# EAGLE design DC950TestSystem (EAGLE 6.6.0)
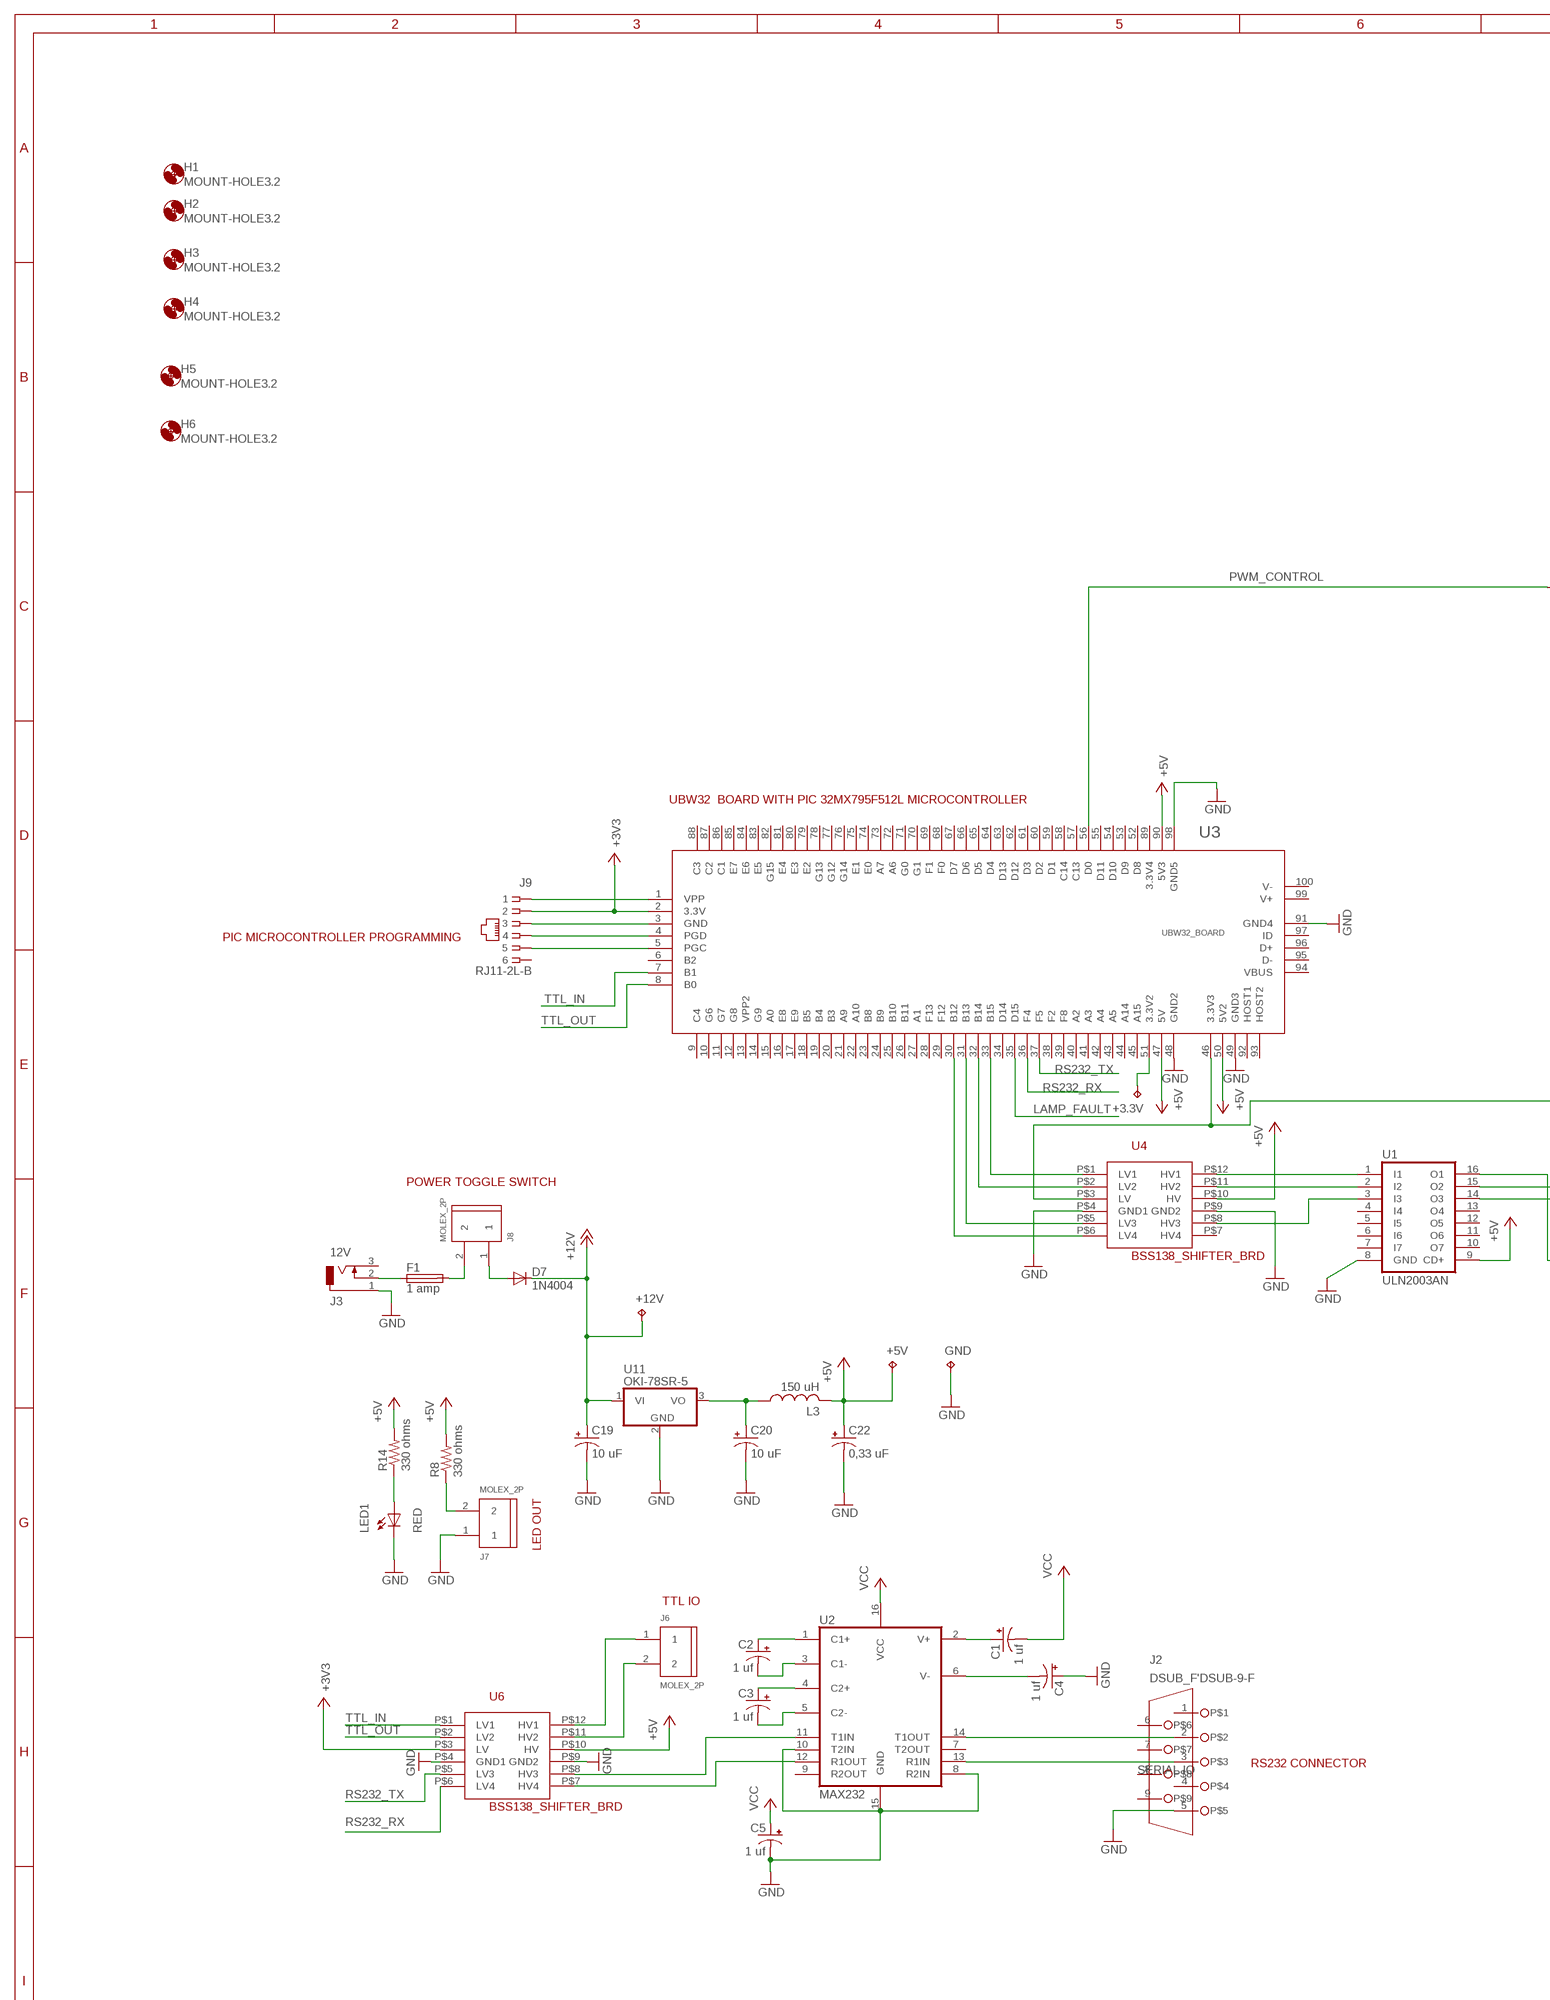
[diagram p0: schematic, sheet 1, part 1 of 2]
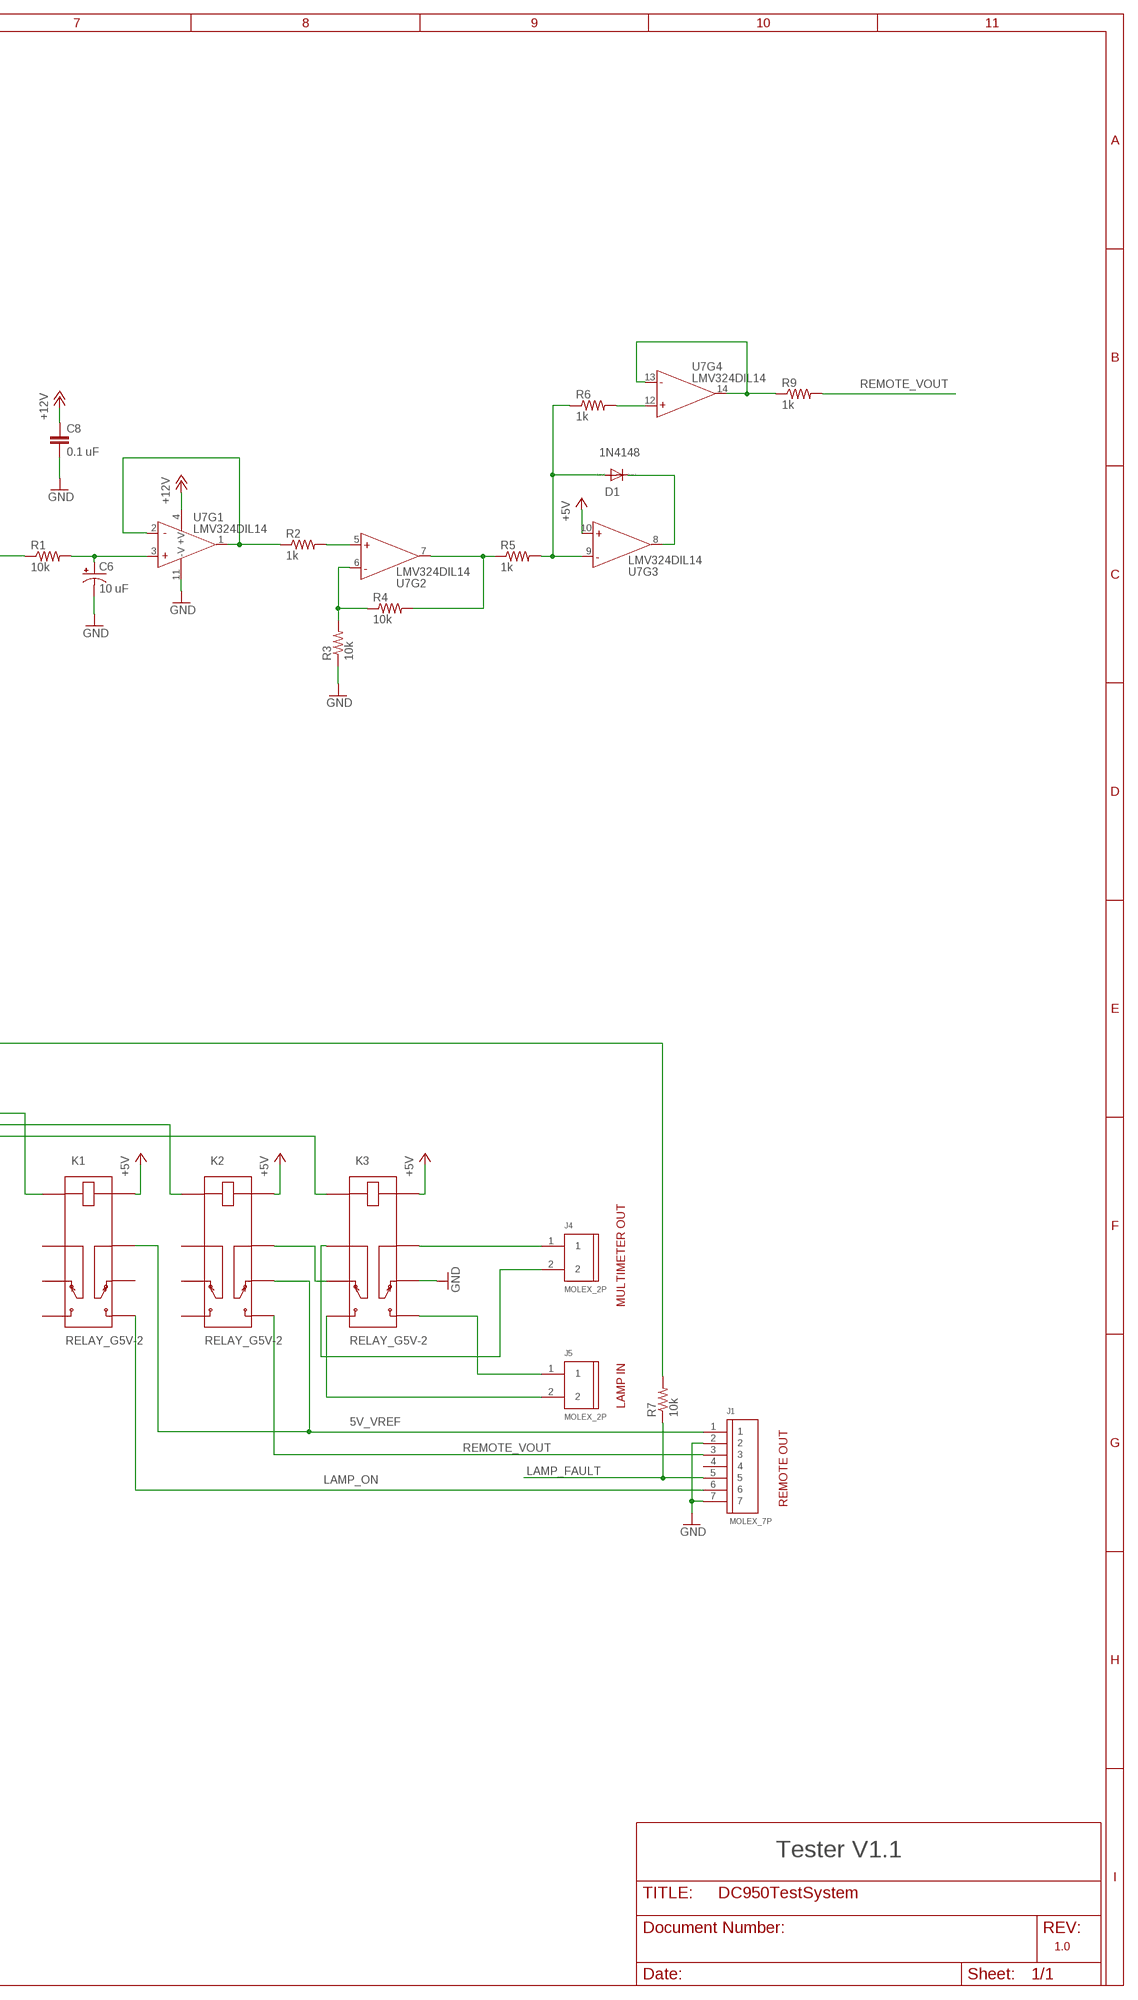
[diagram p1: schematic, sheet 1, part 2 of 2]

## Parts
+3.3V  TP  [TESTPAD]
+5V  TP  [TESTPAD]
+12V  TP  [TESTPAD]
C1  1 uf  CPOL-USE2-5  [E2-5]
C2  1 uf  CPOL-USE2-5  [E2-5]
C3  1 uf  CPOL-USE2-5  [E2-5]
C4  1 uf  CPOL-USE2-5  [E2-5]
C5  1 uf  CPOL-USE2-5  [E2-5]
C6  10 uF  CPOL-USE2-5  [E2-5]
C8  0.1 uF  C5/2.5  [C5B2.5]
C19  10 uF  CPOL-USE2-5  [E2-5]
C20  10 uF  CPOL-USE2-5  [E2-5]
C22  0,33 uF  CPOL-USE2-5  [E2-5]
D1  1N4148  1N4148DO35-10  [DO35-10]
D7  1N4004  [DO41-10]
F1  1 amp  SH22,5  [SH22,5]
GND  TP  [TESTPAD]
H1  MOUNT-HOLE3.2  [3,2]
H2  MOUNT-HOLE3.2  [3,2]
H3  MOUNT-HOLE3.2  [3,2]
H4  MOUNT-HOLE3.2  [3,2]
H5  MOUNT-HOLE3.2  [3,2]
H6  MOUNT-HOLE3.2  [3,2]
J1  MOLEX_7P  [MOLEX_7P]
J2  DSUB_F'DSUB-9-F  [H5M09RA]
J3  12V  DCJ0303  [DCJ0303]
J4  MOLEX_2P  [MOLEX_2P]
J5  MOLEX_2P  [MOLEX_2P]
J6  MOLEX_2P  [MOLEX_2P]
J7  MOLEX_2P  [MOLEX_2P]
J8  MOLEX_2P  [MOLEX_2P]
J9  RJ11-2L-B  [RJ11-NO_SHIELD]
K1  RELAY_G5V-2  [RELAY_G5V-2]
K2  RELAY_G5V-2  [RELAY_G5V-2]
K3  RELAY_G5V-2  [RELAY_G5V-2]
L3  150 uH  L-US0204/7  [0204/7]
LED1  RED  LED5MM  [LED5MM]
R1  10k  RESISTOR0207/12  [1/4_WATT]
R2  1k  RESISTOR0207/12  [1/4_WATT]
R3  10k  RESISTOR0207/12  [1/4_WATT]
R4  10k  RESISTOR0207/12  [1/4_WATT]
R5  1k  RESISTOR0207/12  [1/4_WATT]
R6  1k  RESISTOR0207/12  [1/4_WATT]
R7  10k  RESISTOR0207/12  [1/4_WATT]
R8  330 ohms  R-US_0207/10  [0207/10]
R9  1k  RESISTOR0207/12  [1/4_WATT]
R14  330 ohms  R-US_0207/10  [0207/10]
U1  ULN2003AN  [DIL16]
U2  MAX232  [DIL16]
U3  UBW32_BOARD  [UBW32]
U4  BSS138_SHIFTER_BRD  [BSS138_SHIFTER_BRD]
U6  BSS138_SHIFTER_BRD  [BSS138_SHIFTER_BRD]
U7  LMV324DIL14  [DIL14]
U11  OKI-78SR-5  7805TV  [TO220V]

## Nets
5V_VREF: J1.1 K1.13 K2.11
+3V3: J9.2 U3.2(3.3V) U6.P$3(LV)
+5V: +5V.P$1(TP) C22.+ K1.16 K2.16 K3.16 L3.2 R8.2 R14.2 U1.9(CD+) U3.47(5V) U3.50(5V2) U3.90(5V3) U4.P$10(HV) U6.P$10(HV) U7.10(+IN)
+12V: +12V.P$1(TP) C8.1 C19.+ D7.C U7.4(+V) U11.1(VI)
GND: C4.+ C5.- C6.- C8.2 C19.- C20.- C22.- GND.P$1(TP) J1.2 J1.7 J2.5 J3.1 J7.1 K3.11 LED1.K(C) R3.1 U1.8(GND) U2.8(R2IN) U2.10(T2IN) U2.15(GND) U3.48(GND2) U3.49(GND3) U3.91(GND4) U3.98(GND5) U4.P$4(GND1) U4.P$9(GND2) U6.P$4(GND1) U6.P$9(GND2) U7.11(-V) U11.2(GND)
LAMP_FAULT: J1.5 R7.1 U3.35(D15)
LAMP_ON: J1.6 K1.9
N$1: F1.1 J3.2
N$2: J9.3 U3.3(GND)
N$3: F1.2 J8.2
N$4: U2.12(R1OUT) U6.P$7(HV4)
N$5: U2.11(T1IN) U6.P$8(HV3)
N$6: J9.1 U3.1(VPP)
N$7: J6.1 U6.P$12(HV1)
N$8: J9.4 U3.4(PGD)
N$9: J9.5 U3.5(PGC)
N$10: R2.1 U7.1(OUT) U7.2(-IN)
N$11: C6.+ R1.2 U7.3(+IN)
N$12: R3.2 R4.1 U7.6(-IN)
N$13: R4.2 R5.1 U7.7(OUT)
N$14: J6.2 U6.P$11(HV2)
N$15: R2.2 U7.5(+IN)
N$16: D1.A R5.2 R6.1 U7.9(-IN)
N$17: D1.C U7.8(OUT)
N$18: LED1.A R14.1
N$19: J2.2 U2.14(T1OUT)
N$20: J2.3 U2.13(R1IN)
N$21: R6.2 U7.12(+IN)
N$22: R7.2 U3.46(3.3V3) U4.P$3(LV)
N$23: C2.+ U2.1(C1+)
N$24: C2.- U2.3(C1-)
N$25: C3.+ U2.4(C2+)
N$26: C3.- U2.5(C2-)
N$27: C1.+ U2.2(V+)
N$28: C4.- U2.6(V-)
N$29: U3.33(B15) U4.P$1(LV1)
N$30: U3.32(B14) U4.P$2(LV2)
N$31: U3.31(B13) U4.P$5(LV3)
N$32: U3.30(B12) U4.P$6(LV4)
N$33: +3.3V.P$1(TP) U3.51(3.3V2)
N$34: U1.1(I1) U4.P$12(HV1)
N$35: U1.2(I2) U4.P$11(HV2)
N$36: U1.3(I3) U4.P$8(HV3)
N$37: J7.2 R8.1
N$38: K1.1 U1.16(O1)
N$39: K2.1 U1.15(O2)
N$40: K3.1 U1.14(O3)
N$41: D7.A J8.1
N$42: C20.+ L3.1 U11.3(VO)
N$43: J4.1 K3.13
N$44: J4.2 K3.4
N$45: J5.1 K3.9
N$46: J5.2 K3.8
N$47: K2.13 K3.6
N$48: R9.1 U7.13(-IN) U7.14(OUT)
PWM_CONTROL: R1.1 U3.56(D0)
REMOTE_VOUT: J1.3 K2.9 R9.2
RS232_RX: U3.36(F4) U6.P$6(LV4)
RS232_TX: U3.37(F5) U6.P$5(LV3)
TTL_IN: U3.7(B1) U6.P$1(LV1)
TTL_OUT: U3.8(B0) U6.P$2(LV2)
VCC: C1.- C5.+ U2.16(VCC)
Unconnected: J1.4 J2.1 J2.4 J2.6 J2.7 J2.8 J2.9 J3.3 J9.6 K1.4 K1.6 K1.8 K1.11 K2.4 K2.6 K2.8 U1.4(I4) U1.5(I5) U1.6(I6) U1.7(I7) U1.10(O7) U1.11(O6) U1.12(O5) U1.13(O4) U2.7(T2OUT) U2.9(R2OUT) U3.6(B2) U3.9(C4) U3.10(G6) U3.11(G7) U3.12(G8) U3.13(VPP2) U3.14(G9) U3.15(A0) U3.16(E8) U3.17(E9) U3.18(B5) U3.19(B4) U3.20(B3) U3.21(A9) U3.22(A10) U3.23(B8) U3.24(B9) U3.25(B10) U3.26(B11) U3.27(A1) U3.28(F13) U3.29(F12) U3.34(D14) U3.38(F2) U3.39(F8) U3.40(A2) U3.41(A3) U3.42(A4) U3.43(A5) U3.44(A14) U3.45(A15) U3.52(D8) U3.53(D9) U3.54(D10) U3.55(D11) U3.57(C13) U3.58(C14) U3.59(D1) U3.60(D2) U3.61(D3) U3.62(D12) U3.63(D13) U3.64(D4) U3.65(D5) U3.66(D6) U3.67(D7) U3.68(F0) U3.69(F1) U3.70(G1) U3.71(G0) U3.72(A6) U3.73(A7) U3.74(E0) U3.75(E1) U3.76(G14) U3.77(G12) U3.78(G13) U3.79(E2) U3.80(E3) U3.81(E4) U3.82(G15) U3.83(E5) U3.84(E6) U3.85(E7) U3.86(C1) U3.87(C2) U3.88(C3) U3.92(HOST1) U3.93(HOST2) U3.95(D-) U3.96(D+) U3.97(ID) U4.P$7(HV4)

## Notes on the sheet
- UBW32  BOARD WITH PIC 32MX795F512L MICROCONTROLLER
- PIC MICROCONTROLLER PROGRAMMING
- POWER TOGGLE SWITCH
- MULTIMETER OUT
- LAMP IN
- LED OUT
- REMOTE OUT
- TTL IO
- RS232 CONNECTOR
- SERIAL IO
- Tester V1.1
- 1.0

## Power pins joined to a net without a drawn wire
3.3V4: U3.89(3.3V4)
V+: U3.99(V+)
V-: U3.100(V-)
VBUS: U3.94(VBUS)

## Library data of the parts
+3.3V +5V +12V GND = JimLib:TP: Test pad
C1-C6 C19 C20 C22 = rcl:CPOL-US: POLARIZED CAPACITOR, American symbol
C8 = capacitor-wima:C: CAPACITOR naming: grid - package width
D1 = JimLib:1N4148: DIODE high speed (Philips)
D7 = diode:1N4004: DIODE general purpose rectifier, 1 A
F1 = fuse:SH22,5: FUSE HOLDER grid 22,5 mm, OGN0031 8201, Schurter (Buerklin); MF: SCHURTER; MPN: 0031.8201; OC_FARNELL: 1162740; OC_NEWARK: 96F8317
H1-H6 = holes:MOUNT-HOLE: MOUNTING HOLE with drill center marker
J1 = JimLib:MOLEX_7P
J2 = Jim Lib1:DSUB_F: FEMALE RIGHT ANGLE DSUB 9
J3 = con-jack:DCJ0303: DC POWER JACK Source: DCJ0303.pdf; OC_FARNELL: unknown; OC_NEWARK: unknown
J4-J8 = JimLib:MOLEX_2P
J9 = con-tycoelectronics:RJ11: CORCOM Modular RJ Jacks No Shield Source: www.tycoelectronics.com .. ENG_DS_1654001_1099_RJ_L_0507.pdf; MF: TYCO ELECTRONICS; MPN: RJ11-2L-B; OC_FARNELL: unknown; OC_NEWARK: 83F4463
K1-K3 = JimLib:RELAY_G5V-2
L3 = resistor:L-US: INDUCTOR, American symbol
LED1 = led:LED: LED OSRAM: - CHIPLED LG R971, LG N971, LY N971, LG Q971, LY Q971, LO R971, LY R971 LH N974, LH R974 LS Q976, LO Q976, LY Q976 LO Q996 - Hyper CHIPLED LW Q18S LB Q993, LB Q99A, LB R99A - SideLED LS A670, LO A670, LY A670, LG A670, LP A670 LB A673, LV A673, LT A673, LW A673 LH A674 LY A675 LS A676, LA A676, LO A676, LY A676, LW A676 LS A679, LY A679, LG A679 - Hyper Micro SIDELED® LS Y876, LA Y876, LO Y876, LY Y876 LT Y87S - SmartLED LW L88C, LW L88S LB L89C, LB L89S, LG L890 LS L89K, LO L89K, LY L89K LS L896, LA L896, LO L896, LY L896 - TOPLED LS T670, LO T670, LY T670, LG T670, LP T670 LSG T670, LSP T670, LSY T670, LOP T670, LYG T670 LG T671, LOG T671, LSG T671 LB T673, LV T673, LT T673, LW T673 LH T674 LS T676, LA T676, LO T676, LY T676, LB T676, LH T676, LSB T676, LW T676 LB T67C, LV T67C, LT T67C, LS T67K, LO T67K, LY T67K, LW E67C LS E67B, LA E67B, LO E67B, LY E67B, LB E67C, LV E67C, LT E67C LW T67C LS T679, LY T679, LG T679 LS T770, LO T770, LY T770, LG T770, LP T770 LB T773, LV T773, LT T773, LW T773 LH T774 LS E675, LA E675, LY E675, LS T675 LS T776, LA T776, LO T776, LY T776, LB T776 LHGB T686 LT T68C, LB T68C - Hyper Mini TOPLED® LB M676 - Mini TOPLED Santana® LG M470 LS M47K, LO M47K, LY M47K Source: http://www.osram.convergy.de LUXEON: - LUMILED® LXK2-PW12-R00, LXK2-PW12-S00, LXK2-PW14-U00, LXK2-PW14-V00 LXK2-PM12-R00, LXK2-PM12-S00, LXK2-PM14-U00 LXK2-PE12-Q00, LXK2-PE12-R00, LXK2-PE12-S00, LXK2-PE14-T00, LXK2-PE14-U00 LXK2-PB12-K00, LXK2-PB12-L00, LXK2-PB12-M00, LXK2-PB14-N00, LXK2-PB14-P00, LXK2-PB14-Q00 LXK2-PR12-L00, LXK2-PR12-M00, LXK2-PR14-Q00, LXK2-PR14-R00 LXK2-PD12-Q00, LXK2-PD12-R00, LXK2-PD12-S00 LXK2-PH12-R00, LXK2-PH12-S00 LXK2-PL12-P00, LXK2-PL12-Q00, LXK2-PL12-R00 Source: www.luxeon.com KINGBRIGHT: KA-3528ASYC Source: www.kingbright.com
R1-R7 R9 = JimLib:RESISTOR: RESISTOR, American symbol
R8 R14 = resistor:R-US_: RESISTOR, American symbol
U1 = uln-udn:ULN2003A: DRIVER ARRAY
U2 = Jim Lib1:MAX232: RS232 TRANSCEIVER; MF: MAXIM; MPN: MAX232ACPE+; OC_FARNELL: 9723773; OC_NEWARK: 68K4544
U3 = JimLib:UBW32_BOARD: UBW32 - 32 bit PIC32 based USB Bit Whacker Version 2.6 Technical Specifications: PIC 32MX795F512L 8.0 Mhz Crystal VCC: 7.6-15V
U4 U6 = JimLib:BSS138_SHIFTER_BRD
U7 = JimLib:LMV324: Jellybean quad op-amp
U11 = linear:78*: Positive VOLTAGE REGULATOR Source: http://cache.national.com/ds/LM/LM78L05.pdf http://www.fairchildsemi.com/ds/LM/LM7805.pdf

## Board
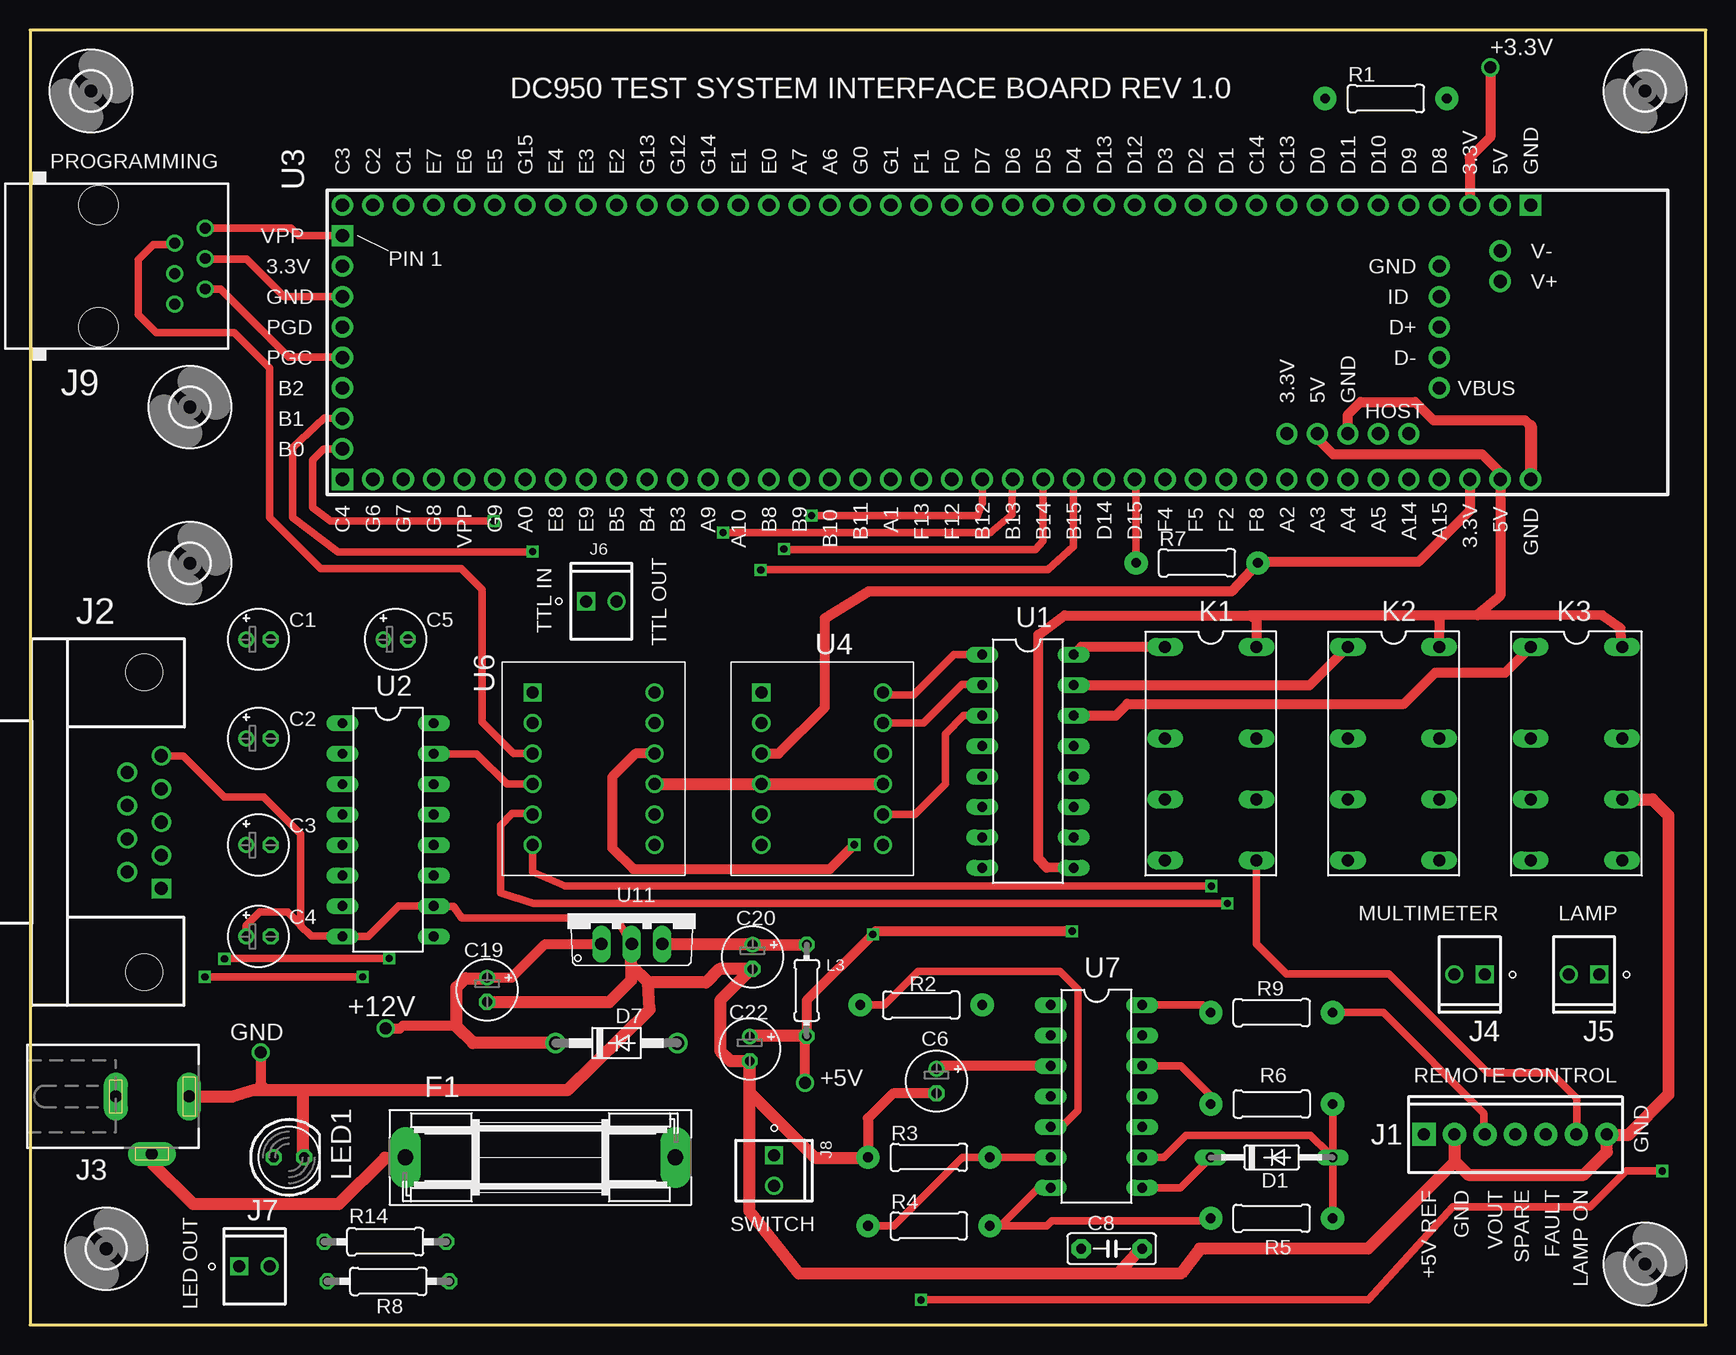
[diagram p2: board, top side]
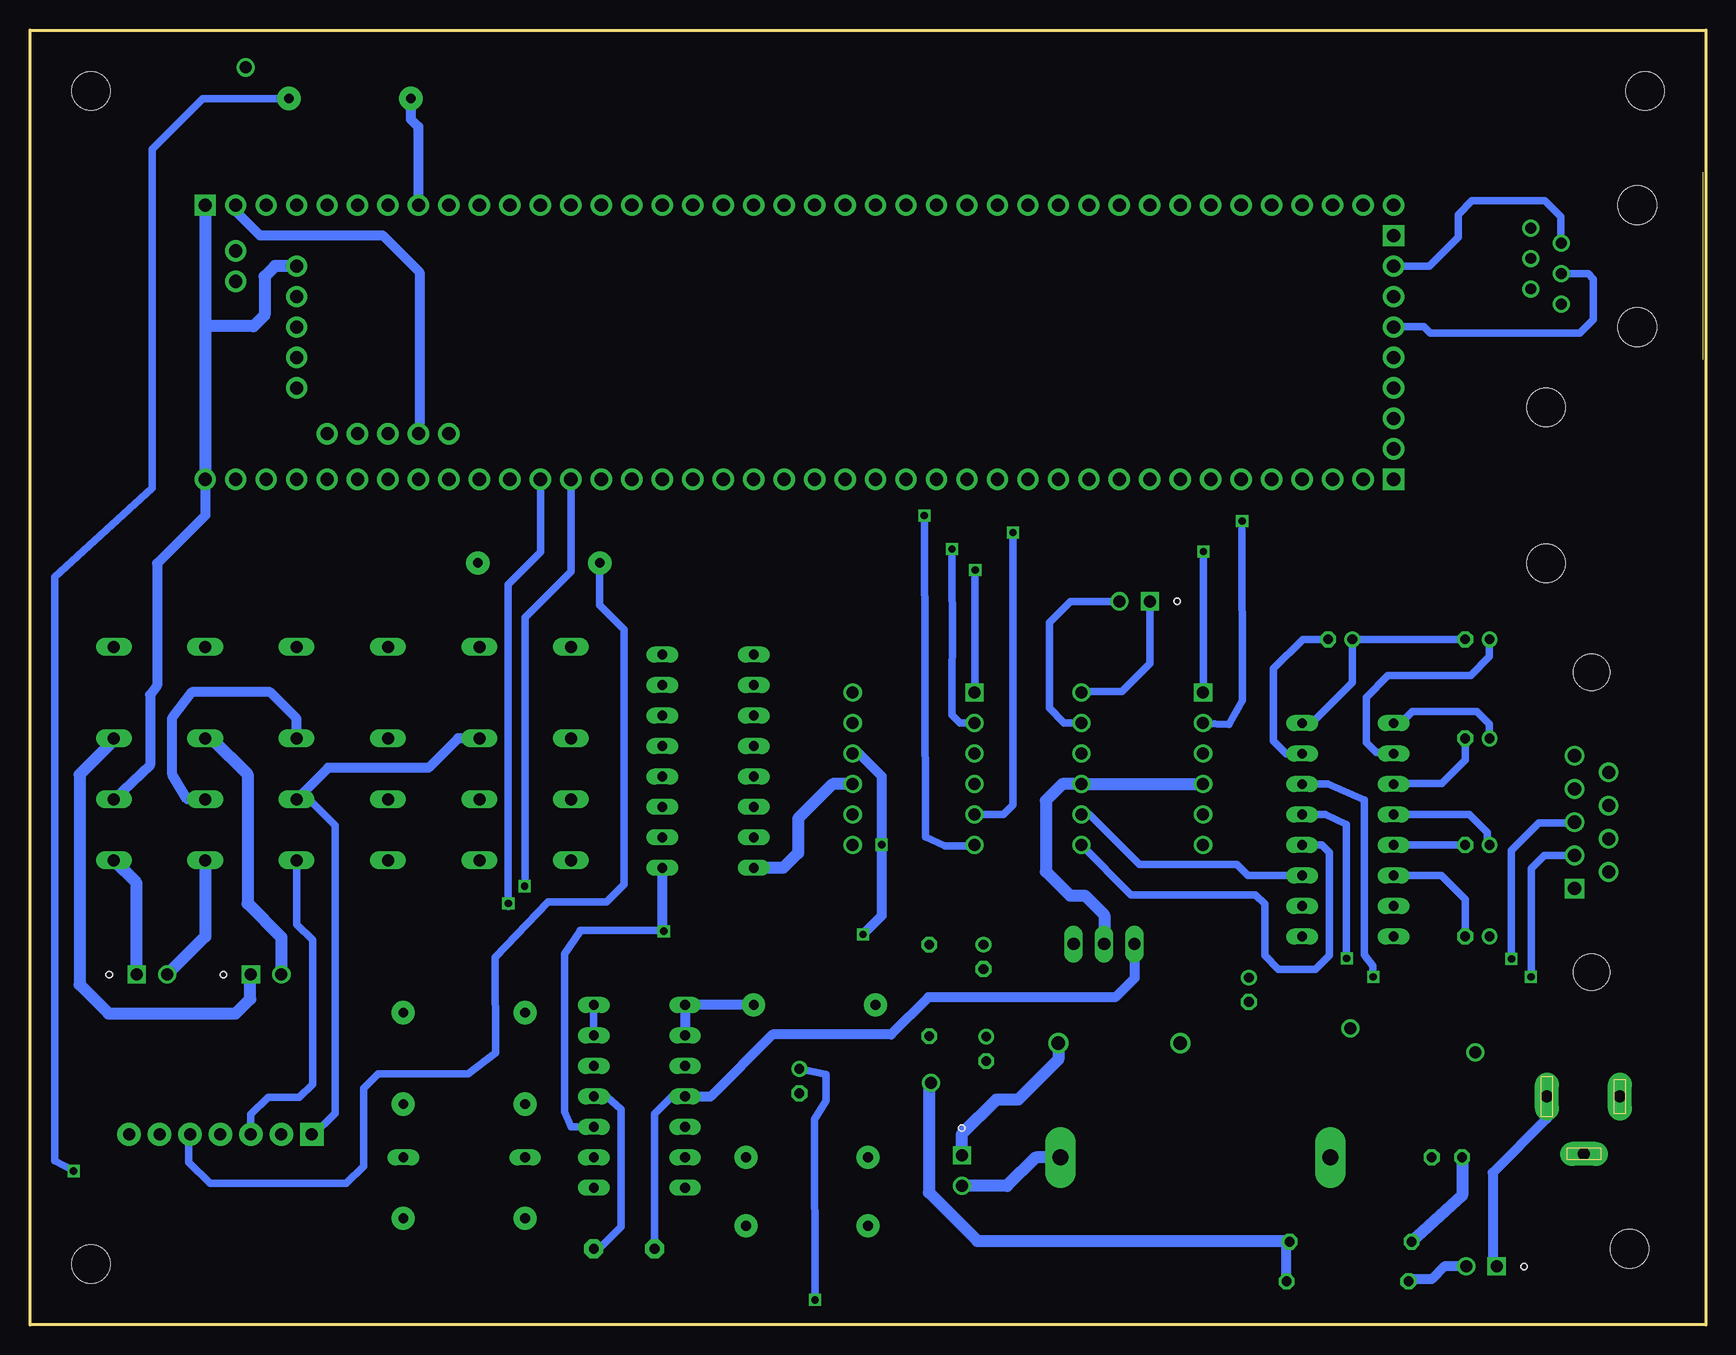
[diagram p3: board, bottom side, seen from below]

Size 139.7 x 107.95 mm. Coordinates in mm from the lower left corner, seen from the top.
Outline: 0,0 139.7,0 139.7,107.95 0,107.95 0,0
Copper layers (1*16): Top 0.035mm / dielectric 1.5mm / Bottom 0.035mm
Design rules "default *": minimum track width 10mil, minimum drill 19mil, track to track 8mil, track to pad 8mil, pad to pad 8mil, via to via 8mil, smd to smd 8mil, copper to edge 40mil, drill to drill 8mil, minimum pad ring 10mil, minimum via ring 8mil, stop-mask expansion 4mil, vias tented up to drill 0mil, thermal gap 10mil

### Footprints (pad centres in the part's own frame; a part is rotated, then mirrored left to right if it is on the bottom)
TESTPAD = drill 1: P$1 0,0
E2-5 = drill 0.813 pad 1.27: + -1.016,0 | drill 0.813 pad 1.27 octagon: - 1.016,0
C5B2.5 = drill 0.813 pad 1.6 octagon: 1 -2.54,0; 2 2.54,0
DO35-10 = drill 0.813 long: A 5.08,0; C -5.08,0
DO41-10 = drill 1.118: A 5.08,0; C -5.08,0
SH22,5 = drill 1.321 pad 2.54 long: 1 -11.252,0; 2 11.252,0
3,2 = hole 3.2: 0,0
MOLEX_7P = drill 1 pad 1.93 square: 1 -3.81,0 | drill 1 pad 1.93: 2 -1.27,0; 3 1.27,0; 4 3.81,0; 5 6.35,0; 6 8.89,0; 7 11.43,0
H5M09RA = drill 1.092 square: 1 5.537,1.422 | drill 1.092: 2 2.769,1.422; 3 0,1.422; 4 -2.769,1.422; 5 -5.537,1.422; 6 4.153,-1.422; 7 1.384,-1.422; 8 -1.384,-1.422; 9 -4.153,-1.422 | hole 3.048: -12.497,0; 12.497,0
DCJ0303 = drill 1 pad 2 long: 1 0,3.1; 2 4.8,0; 3 0,-3
MOLEX_2P = drill 1 square: 1 -1.27,0 | drill 1: 2 1.27,0
RJ11-NO_SHIELD = drill 0.9 pad 1.4: 1 -3.175,8.89; 2 -1.905,6.35; 3 -0.635,8.89; 4 0.635,6.35; 5 1.905,8.89; 6 3.175,6.35 | hole 3.251: -5.08,0; 5.08,0
RELAY_G5V-2 = drill 1 long: 1 -5.08,-3.81; 4 2.54,-3.81; 6 7.62,-3.81; 8 12.7,-3.81; 9 12.7,3.81; 11 7.62,3.81; 13 2.54,3.81; 16 -5.08,3.81
0204/7 = drill 0.813 octagon: 1 -3.81,0; 2 3.81,0
LED5MM = drill 0.813 octagon: A -1.27,0; K 1.27,0
1/4_WATT = drill 0.813 pad 1.93: 1 -5.08,0; 2 5.08,0
0207/10 = drill 0.813 octagon: 1 -5.08,0; 2 5.08,0
DIL16 = drill 0.813 long: 1 -8.89,-3.81; 2 -6.35,-3.81; 3 -3.81,-3.81; 4 -1.27,-3.81; 5 1.27,-3.81; 6 3.81,-3.81; 7 6.35,-3.81; 8 8.89,-3.81; 9 8.89,3.81; 10 6.35,3.81; 11 3.81,3.81; 12 1.27,3.81; 13 -1.27,3.81; 14 -3.81,3.81; 15 -6.35,3.81; 16 -8.89,3.81
UBW32 = drill 1.1 pad 1.778 square: 1 -49.53,8.89; 9 -49.53,-11.43; 49 49.53,11.43 | drill 1.1 pad 1.778: 2 -49.53,6.35; 3 -49.53,3.81; 4 -49.53,1.27; 5 -49.53,-1.27; 6 -49.53,-3.81; 7 -49.53,-6.35; 8 -49.53,-8.89; 10 -46.99,-11.43; 11 -44.45,-11.43; 12 -41.91,-11.43; 13 -39.37,-11.43; 14 -36.83,-11.43; 15 -34.29,-11.43; 16 -31.75,-11.43; 17 -29.21,-11.43; 18 -26.67,-11.43; 19 -24.13,-11.43; 20 -21.59,-11.43; 21 -19.05,-11.43; 22 -16.51,-11.43; 23 -13.97,-11.43; 24 -11.43,-11.43; 25 -8.89,-11.43; 26 -6.35,-11.43; 27 -3.81,-11.43; 28 -1.27,-11.43; 29 1.27,-11.43; 30 3.81,-11.43; 31 6.35,-11.43; 32 8.89,-11.43; 33 11.43,-11.43; 34 13.97,-11.43; 35 16.51,-11.43; 36 19.05,-11.43; 37 21.59,-11.43; 38 24.13,-11.43; 39 26.67,-11.43; 40 29.21,-11.43; 41 31.75,-11.43; 42 34.29,-11.43; 43 36.83,-11.43; 44 39.37,-11.43; 45 41.91,-11.43; 46 44.45,-11.43; 47 46.99,-11.43; 48 49.53,-11.43; 50 46.99,11.43; 51 44.45,11.43; 52 41.91,11.43; 53 39.37,11.43; 54 36.83,11.43; 55 34.29,11.43; 56 31.75,11.43; 57 29.21,11.43; 58 26.67,11.43; 59 24.13,11.43; 60 21.59,11.43; 61 19.05,11.43; 62 16.51,11.43; 63 13.97,11.43; 64 11.43,11.43; 65 8.89,11.43; 66 6.35,11.43; 67 3.81,11.43; 68 1.27,11.43; 69 -1.27,11.43; 70 -3.81,11.43; 71 -6.35,11.43; 72 -8.89,11.43; 73 -11.43,11.43; 74 -13.97,11.43; 75 -16.51,11.43; 76 -19.05,11.43; 77 -21.59,11.43; 78 -24.13,11.43; 79 -26.67,11.43; 80 -29.21,11.43; 81 -31.75,11.43; 82 -34.29,11.43; 83 -36.83,11.43; 84 -39.37,11.43; 85 -41.91,11.43; 86 -44.45,11.43; 87 -46.99,11.43; 88 -49.53,11.43; 89 29.21,-7.62; 90 31.75,-7.62; 91 34.29,-7.62; 92 36.83,-7.62; 93 39.37,-7.62; 94 41.91,-3.81; 95 41.91,-1.27; 96 41.91,1.27; 97 41.91,3.81; 98 41.91,6.35; 99 46.99,5.08; 100 46.99,7.62
BSS138_SHIFTER_BRD = drill 1 square: P$1 -5.08,-5.08 | drill 1: P$2 -2.54,-5.08; P$3 0,-5.08; P$4 2.54,-5.08; P$5 5.08,-5.08; P$6 7.62,-5.08; P$7 7.62,5.08; P$8 5.08,5.08; P$9 2.54,5.08; P$10 0,5.08; P$11 -2.54,5.08; P$12 -5.08,5.08
DIL14 = drill 0.813 long: 1 -8.89,-3.81; 2 -6.35,-3.81; 3 -3.81,-3.81; 4 -1.27,-3.81; 5 1.27,-3.81; 6 3.81,-3.81; 7 6.35,-3.81; 8 6.35,3.81; 9 3.81,3.81; 10 1.27,3.81; 11 -1.27,3.81; 12 -3.81,3.81; 13 -6.35,3.81; 14 -8.89,3.81
TO220V = drill 1.016 long: 1 -2.54,-2.54; 2 0,-2.54; 3 2.54,-2.54

### Placement (x,y rotation side)
+3.3V  121.72,104.83 0 top
+5V  64.59,20.17 0 top
+12V  29.64,24.71 0 top
C1  19.05,57.15 0 top
C2  19.05,48.9 0 top
C3  19.05,40.01 0 top
C4  19.05,32.38 0 top
C5  30.48,57.15 0 top
C6  75.56,20.32 270 top
C8  90.17,6.35 0 top
C19  38.1,27.94 270 top
C20  60.22,30.68 270 top
C22  59.99,23.01 270 top
D1  103.5,13.97 0 top
D7  48.9,23.5 0 top
F1  42.55,13.97 0 top
GND  19.23,22.71 0 top
H1  5.08,102.87 0 top
H2  6.35,6.35 0 top
H3  134.62,5.08 0 top
H4  134.62,102.87 0 top
H5  13.34,76.5 0 top
H6  13.34,63.5 0 top
J1  120.02,15.88 0 top
J2  9.53,41.91 270 top
J3  10.16,19.05 270 top
J4  120.02,29.21 180 top
J5  129.54,29.21 180 top
J6  47.62,60.33 0 top
J7  18.72,4.88 0 top
J8  62.03,12.85 270 top
J9  5.71,88.27 270 top
K1  98.42,51.44 270 top
K2  113.67,51.44 270 top
K3  128.91,51.44 270 top
L3  64.74,27.89 270 top
LED1  21.59,13.97 0 top
R1  113.03,102.23 0 top
R2  74.3,26.67 180 top
R3  74.93,13.97 0 top
R4  74.93,8.26 0 top
R5  103.5,8.89 0 top
R6  103.5,18.41 180 top
R7  97.28,63.53 0 top
R8  29.87,3.63 0 top
R9  103.5,26.04 0 top
R14  29.62,6.93 0 top
U1  83.19,46.99 270 top
U2  29.84,41.27 270 top
U3  75.56,81.92 0 top
U4  66.04,47.62 270 top
U6  46.99,47.62 270 top
U7  88.9,17.78 270 top
U11  50.16,34.29 0 top

### Tracks (layer width: path | path; a pad name or v marks a point on that pad's centre or on a via)
5V_VREF
  Bottom 0.61: J1.1 116.2,15.72 114.28,17.65 114.28,41.66 116.43,43.81 K2.11
  Bottom 0.813: K1.13 104.01,48.9 106.48,46.43 114.86,46.43 K2.11
+3V3
  Top 0.61: U6.P$3 40.31,47.62 37.67,50.27 37.67,61.32 35.94,63.04 24.23,63.04 19.99,67.28 19.99,79.76 17.02,82.73 10.52,82.73 9.02,84.23 9.02,88.82 10.26,90.07 11.96,90.07 J9.2
  Bottom 0.61: U3.2 23.06,88.27 20.65,90.68 20.65,92.56 19.51,93.7 13.41,93.7 12.12,92.41 12.12,90.22 J9.2
+5V  (via drill 0.6)
  Top 0.813: K3.16 132.56,58.09 131.06,59.16 120.65,59.17 | 120.65,59.17 117.53,59.16 | 117.53,59.16 101.85,59.16 | 101.73,59.16 102.21,58.78 | 102.21,58.78 102.21,56.54 K1.16 | K2.16 117.53,59.16 | 117.45,58.73 117.53,59.16 | U1.9 84.73,38.12 84.05,38.86 84.05,57.53 86.23,59.16 101.73,59.16 | 101.73,59.16 101.85,59.16 | 101.85,59.16 102.21,58.78 | v86.87,32.82 70.51,32.82 v70.26,32.56 64.75,27.05 L3.2 64.59,23.93 +5V.P$1 | 120.65,59.17 122.56,60.77 U3.47 122.56,71.07 121.03,72.59 108.61,72.59 107.31,73.89 U3.90 | U6.P$10 50.49,47.62 48.54,45.67 48.54,39.75 50.29,38 66.67,38 v68.71,40.03
  Top 1.016: L3.2 60.05,24.08 C22.+
  Bottom 0.61: U7.10 94.59,16.51 95.15,17.75 95.15,30.94 93.85,32.82 93.85,32.89 86.94,32.89 v86.87,32.82 | 64.77,19.99 +5V.P$1
  Bottom 0.813: U1.9 87,32.94 v86.87,32.82 | U4.P$10 70.59,47.62 68.71,45.74 v68.71,40.03 68.71,34.11 v70.26,32.56 | U3.50 122.56,92.84 120.55,90.83 110.31,90.83 107.24,87.76 107.24,74.37 U3.90 | R8.2 34.95,6.68 R14.2
  Bottom 1.016: 64.77,19.99 64.77,11.05 60.73,7.01 34.77,7.01 R14.2
+12V
  Top 0.813: C19.+ 40.16,28.96 42.95,31.75 U11.1 | +12V.P$1 30.84,24.71 31.09,24.97 35.38,24.97 35.56,25.15
  Top 1.016: D7.C 36.93,23.5 35.56,24.87 35.56,25.15 35.56,28.14 36.32,28.91 38.05,28.91 C19.+
  Bottom 0.61: C8.1 87.63,17.6 86.16,19.07 85.11,19.07 U7.4
  Bottom 0.813: U11.1 47.62,28.91 49.23,27.3 64.82,27.3 67.92,24.21 77.8,24.21 82.98,19.02 85.06,19.02 U7.4
GND
  Top 0.61: J2.5 12.78,47.45 16.2,44.02 19.48,44.02 22.58,40.92 22.58,33.3 | 22.58,33.3 22.58,33.25 23.42,32.41 26.01,32.41 U2.8 28.19,32.38 30.73,34.92 U2.10 33.71,34.87 35.33,34.87 35.97,33.93 48.87,33.93 U11.2 | 22.58,33.3 21.46,34.42 19.13,34.42 18.01,33.3 18.01,32.41 C4.+ | U6.P$4 39.75,45.09 37.24,47.6 33.68,47.6 U2.15
  Top 0.813: C6.- 71.93,19.3 69.85,17.22 R3.1 | U3.91 109.86,75.89 110.9,76.94 115.47,76.94 116.99,75.41 124.61,75.41 125.09,74.93 | GND.P$1 19.23,20.09 19.74,19.58
  Top 1.016: 125.09,74.93 U3.48 | 51.51,28.55 56.34,28.55 57.45,29.67 C20.- 60.15,29.67 57.53,27.05 57.53,22.86 58.4,22 C22.- | 51.51,28.55 50.11,29.95 | 50.11,29.95 50.11,31.7 U11.2 | J3.1 16.89,19.05 18.69,19.58 19.74,19.58 22.76,19.58 | 22.76,19.58 44.81,19.58 51.66,26.31 51.51,28.55 | LED1.K 22.76,14.48 22.76,19.58 | U6.P$9 U4.P$4 U4.P$9 | 50.11,29.95 50.11,28.73 48.28,26.9 38.12,26.9 C19.- | C22.- 59.99,19.38 65.43,13.95 69.83,13.95 R3.1 | C8.2 92.56,6.35 90.7,4.27 | 90.7,4.27 64.08,4.27 59.97,9.47 59.97,21.97 C22.- | 90.7,4.27 95.94,4.27 97.51,6.35 111.53,6.35 118.75,13.56 J1.2 118.75,13.66 119.89,12.52 129.54,12.52 131.44,14.43 J1.7 131.5,15.82 133.2,15.82 136.58,19.2 136.58,42.47 135.23,43.81 K3.11
  Bottom 0.61: 33.76,47.52 U2.15 33.68,47.6 34.95,47.6 36.04,48.69 36.04,54.71 33.6,57.15 C5.- | C8.2 92.28,6.35 90.45,8.18 90.45,17.96 91.59,19 91.64,19.05 U7.11
  Bottom 0.813: U3.48 125.09,67.49 129.11,63.48 129.11,53.29 129.69,52.53 129.69,46.66 K3.11 | J3.1 13.26,17.22 17.78,12.7 17.78,5.21 J7.1
  Bottom 1.016: 50.11,31.7 U11.2 50.14,31.77 50.14,34.16 51.77,35.79 53.01,35.79 55.02,37.8 55.02,43.71 53.65,45.09 U6.P$9 U6.P$4 | U4.P$9 72.8,45.09 75.67,42.22 75.67,39.34 76.91,38.1 U1.8 | U3.49 125.09,83.31 | 125.09,83.31 U3.48 | U3.98 119.28,88.27 120.14,87.4 120.14,84.18 121.06,83.26 125.04,83.26 125.09,83.31
LAMP_FAULT
  Top 0.61: R7.1 92.2,70.36 U3.35
  Bottom 0.61: R7.1 92.2,60.02 90.17,57.99 90.17,36.73 91.62,35.28 96.5,35.28 100.94,30.63 100.89,22.68 103.17,20.93 110.69,20.93 111.89,19.74 111.89,13.23 113.33,11.79 124.69,11.79 126.47,13.56 126.47,15.77 J1.5
LAMP_ON
  Top 0.61: K1.9 102.23,31.77 104.75,29.26 113.28,29.26 121.54,21.01 126.82,21.01 128.96,18.87 128.96,15.93 J1.6
N$1
  Top 1.016: J3.2 10.16,13.51 13.59,10.08 25.73,10.08 29.59,13.95 31.27,13.95 F1.1
N$2
  Top 0.61: U3.3 21.18,85.72 18.06,88.85 14.66,88.85 J9.3
N$3
  Bottom 1.016: F1.2 55.85,13.97 58.24,11.58 J8.2
N$4
  Bottom 0.61: U2.12 32.03,40.01 31.39,39.37 31.39,30.79 32.54,29.64 35.64,29.64 36.78,30.79 36.78,35.08 37.57,35.87 47.93,35.87 U6.P$7
N$5
  Bottom 0.61: U6.P$8 51.38,42.55 47.22,38.38 39.09,38.38 38.18,37.47 U2.11
N$6
  Top 0.61: J9.1 21.77,91.44 22.4,90.81 U3.1
N$7
  Bottom 0.61: J6.1 46.35,55.14 48.69,52.81 51.97,52.81 U6.P$12
N$8
  Bottom 0.61: J9.4 9.8,87.63 9.37,87.2 9.37,83.82 10.52,82.68 22.96,82.68 23.08,82.79 23.5,83.21 26.01,83.21 U3.4
N$9
  Top 0.61: J9.5 15.88,86.36 21.57,80.67 26.01,80.67 U3.5
N$10
  Bottom 0.813: R2.1 U7.1 U7.2
N$11  (via drill 0.6)
  Top 0.61: v136.07,12.83 133.07,12.83 130.07,9.83 118.62,9.83 111.56,2.11 v74.27,2.08 | C6.+ 75.56,21.36 75.79,21.59 75.95,21.59
  Top 0.813: U7.3 75.95,21.59 C6.+
  Bottom 0.61: R1.2 125.3,102.23 129.51,98.02 129.51,69.75 137.64,62.36 137.64,13.66 v136.07,12.83 | C6.+ 73.33,20.88 73.33,18.67 74.32,17.12 v74.27,2.08
N$12
  Top 0.61: U7.6 R3.2 77.75,13.97 72.03,8.26 R4.1
N$13
  Top 0.61: U7.7 85.04,11.38 84.02,11.38 80.9,8.26 R4.2 84.76,8.26 85.19,8.69 98.22,8.69 R5.1
N$14
  Bottom 0.61: J6.2 52.98,60.33 54.74,58.57 54.74,51.44 53.49,50.19 52.09,50.19 U6.P$11
N$15
  Top 0.61: R2.2 71.22,26.67 74.02,29.46 85.85,29.46 87.35,27.96 87.35,17.91 85.93,16.48 85.11,16.48 U7.5
N$16
  Top 0.61: U7.9 94.51,13.97 96.37,15.82 106.73,15.82 108.23,14.33 | 108.23,14.33 D1.A R5.2 | R6.1 108.58,14.68 108.23,14.33
N$17
  Top 0.61: U7.8 95.89,11.43 D1.C
N$18
  Bottom 1.016: LED1.A 20.32,10.79 R14.1
N$19  (via drill 0.6)
  Top 0.61: v14.58,29.01 v27.74,29.01
  Bottom 0.61: J2.2 13.46,39.14 14.55,38.05 14.55,29.03 v14.58,29.01 | U2.14 33.63,45.11 31.52,45.11 28.47,43.76 28.47,30.86 27.75,29.93 v27.74,29.01
N$20  (via drill 0.6)
  Top 0.61: v29.95,30.56 16.26,30.56 v16.2,30.5
  Bottom 0.61: U2.13 31.73,42.55 29.97,41.71 29.97,30.4 v29.95,30.56 | v16.2,30.5 16.2,39.57 13.92,41.86 11,41.86 J2.3
N$21
  Top 0.61: R6.2 98.42,19.1 95.94,21.59 U7.12
N$22
  Top 0.813: U4.P$3 62.41,47.62 66.27,51.49 66.27,58.93 69.93,61.16 100.18,61.16 R7.2 102.44,63.6 115.72,63.6 120.02,67.89 U3.46
N$23
  Bottom 0.61: U2.1 25.45,50.16 24.49,51.13 19.1,51.13 18.06,50.09 18.06,48.92 C2.+
N$24
  Bottom 0.61: C2.- 20.07,47.09 22.02,45.14 25.98,45.14 U2.3
N$25
  Bottom 0.61: U2.4 19.71,42.55 18.21,41.05 18.21,40.18 C3.+
N$26
  Bottom 0.61: U2.5 C3.-
N$27
  Bottom 0.61: C1.+ 18.03,55.7 19.58,54.15 26.49,54.15 28.32,52.32 28.32,48.56 27.46,47.7 26.11,47.7 U2.2
N$28
  Bottom 0.61: U2.6 22.07,37.47 20.07,35.46 C4.-
N$29  (via drill 0.6)
  Top 0.61: U3.33 86.97,64.87 84.86,62.97 60.96,62.97 v60.91,62.94
  Bottom 0.61: v60.91,62.94 60.91,52.76 U4.P$1
N$30  (via drill 0.6)
  Top 0.61: U3.32 84.45,65.35 83.8,64.64 63.2,64.62 v62.84,64.67
  Bottom 0.61: v62.84,64.67 62.81,55.91 62.87,55.22 62.87,50.85 62.18,50.16 U4.P$2
N$31  (via drill 0.6)
  Top 0.61: v57.76,66.06 80.06,66.06 81.86,67.54 U3.31
  Bottom 0.61: U4.P$5 58.57,42.55 57.76,43.36 v57.76,66.06
N$32  (via drill 0.6)
  Top 0.61: U3.30 79.38,68.53 78.99,67.49 65.79,67.46 v65.15,67.46
  Bottom 0.61: v65.15,67.46 65.08,40.69 63.42,39.93 61.04,39.93 U4.P$6
N$33
  Top 0.813: +3.3V.P$1 121.72,99.01 120.02,97.31 U3.51
N$34
  Top 0.61: U1.1 77.01,55.88 73.66,52.53 71.3,52.53 U4.P$12
N$35
  Top 0.61: U4.P$11 74.47,50.16 77.7,53.39 79.32,53.39 U1.2
N$36
  Top 0.61: U1.3 77.83,50.8 76.3,49.28 76.3,45.09 73.79,42.57 71.14,42.57 U4.P$8
N$37
  Bottom 0.813: J7.2 21.79,4.88 22.86,3.81 24.61,3.81 R8.1
N$38
  Top 0.813: K1.1 87.63,56.52 U1.16
N$39
  Top 0.813: K2.1 106.68,53.34 U1.15
N$40
  Top 0.813: U1.14 90.5,50.8 91.47,51.77 114.53,51.77 117.14,54.38 122.96,54.38 K3.1
N$41
  Bottom 1.016: D7.A 53.98,22.12 57.33,18.77 59.16,18.77 62.05,15.88 62.05,14.15 J8.1
N$42
  Top 1.016: U11.3 60.17,31.75 C20.+ 64.64,31.73 L3.1
N$43
  Bottom 1.016: K3.13 132.72,48.72 135.56,45.87 135.56,28.37 133.15,25.96 122.56,25.96 121.34,27.18 121.34,29.16 J4.1
N$44
  Bottom 1.016: K3.4 124.54,48.9 121.56,45.92 121.56,35.13 118.75,32.31 J4.2
N$45
  Bottom 1.016: J5.1 130.81,36.83 K3.9
N$46
  Bottom 1.016: K3.8 125.09,32.38 J5.2
N$47
  Bottom 0.813: K2.13 117.47,50.55 119.69,52.76 126.21,52.76 127.84,50.62 127.84,45.87 126.59,43.81 K3.6
N$48
  Top 0.61: U7.14 97.79,26.67 R9.1
  Bottom 0.61: U7.13 U7.14
PWM_CONTROL
  Bottom 0.813: R1.1 107.95,100.51 107.34,99.9 107.34,93.37 U3.56
REMOTE_VOUT
  Top 0.61: R9.2 112.8,26.04 121.18,17.65 121.18,15.98 J1.3
  Bottom 0.61: K2.9 117.47,33.4 116.15,32.08 116.15,20.07 117.25,18.97 119.86,18.97 121.28,17.55 J1.3
RS232_RX  (via drill 0.6)
  Top 0.61: v98.48,36.58 44.6,36.58 41.88,37.74 41.88,39.98 U6.P$6
  Bottom 0.61: U3.36 94.61,62.79 98.42,58.98 98.42,36.45 v98.48,36.58
RS232_TX  (via drill 0.6)
  Top 0.61: v99.82,35.13 41.99,35.13 39.22,36.02 39.22,41.63 40.21,42.62 41.83,42.62 U6.P$5
  Bottom 0.61: U3.37 97.16,64.41 99.85,61.72 99.85,34.9 v99.82,35.13
TTL_IN  (via drill 0.6)
  Top 0.61: U3.7 24.51,75.62 21.89,73.13 21.89,67.31 25.68,64.41 41.83,64.41 v41.88,64.47
  Bottom 0.61: v41.88,64.47 41.88,52.73 U6.P$1
TTL_OUT  (via drill 0.6)
  Top 0.61: U3.8 24.46,73 23.55,72.11 23.55,68.15 25.07,67 v38.66,67
  Bottom 0.61: v38.66,67 38.63,52.07 39.78,50.04 41.88,50.14 U6.P$2
VCC
  Bottom 0.61: C1.- C5.+ 29.46,53.54 32.84,50.16 U2.16

### Text on the board
tSilk: DC950 TEST SYSTEM INTERFACE BOARD REV 1.0 | MULTIMETER | LAMP | VOUT | SWITCH | LED OUT
_tsilk: PROGRAMMING | TTL OUT | TTL IN | REMOTE CONTROL | GND | +5V REF | GND | SPARE | FAULT | LAMP ON